# EAGLE design Emotion (EAGLE 9.3.0)
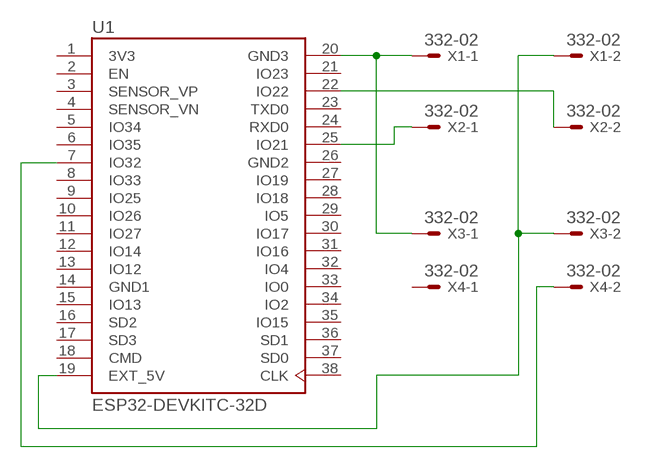
[diagram p0: schematic, sheet 1]

## Parts
U1  ESP32-DEVKITC-32D  [MODULE_ESP32-DEVKITC-32D]
X1  332-02  [332-02]
X2  332-02  [332-02]
X3  332-02  [332-02]
X4  332-02  [332-02]

## Nets
N$1: U1.20(GND3) X1.1 X3.1
N$2: U1.19(EXT_5V) X1.2 X3.2
N$3: U1.25(IO21) X2.1
N$4: U1.22(IO22) X2.2
N$5: U1.7(IO32) X4.2
Unconnected: U1.2(EN) U1.3(SENSOR_VP) U1.4(SENSOR_VN) U1.5(IO34) U1.6(IO35) U1.8(IO33) U1.9(IO25) U1.10(IO26) U1.11(IO27) U1.12(IO14) U1.13(IO12) U1.15(IO13) U1.16(SD2) U1.17(SD3) U1.18(CMD) U1.21(IO23) U1.23(TXD0) U1.24(RXD0) U1.27(IO19) U1.28(IO18) U1.29(IO5) U1.30(IO17) U1.31(IO16) U1.32(IO4) U1.33(IO0) U1.34(IO2) U1.35(IO15) U1.36(SD1) U1.37(SD0) U1.38(CLK) X4.1

## Power pins joined to a net without a drawn wire
3V3: U1.1(3V3)
GND1: U1.14(GND1)
GND2: U1.26(GND2)

## Library data of the parts
U1 = ESP32-DEVKITC-32D:ESP32-DEVKITC-32D: Eval Board For Esp-Wroom-32; AVAILABILITY: Unavailable; DESCRIPTION: Eval Board For Esp-Wroom-32; MF: Espressif Systems; MP: ESP32-DEVKITC-32D; PACKAGE: None; PRICE: None
X1-X4 = con-garry:332-02: 2 Pin - 2mm Dual Row Source: www.mpe-connector.de / garry_shortform_2012.pdf

## Board
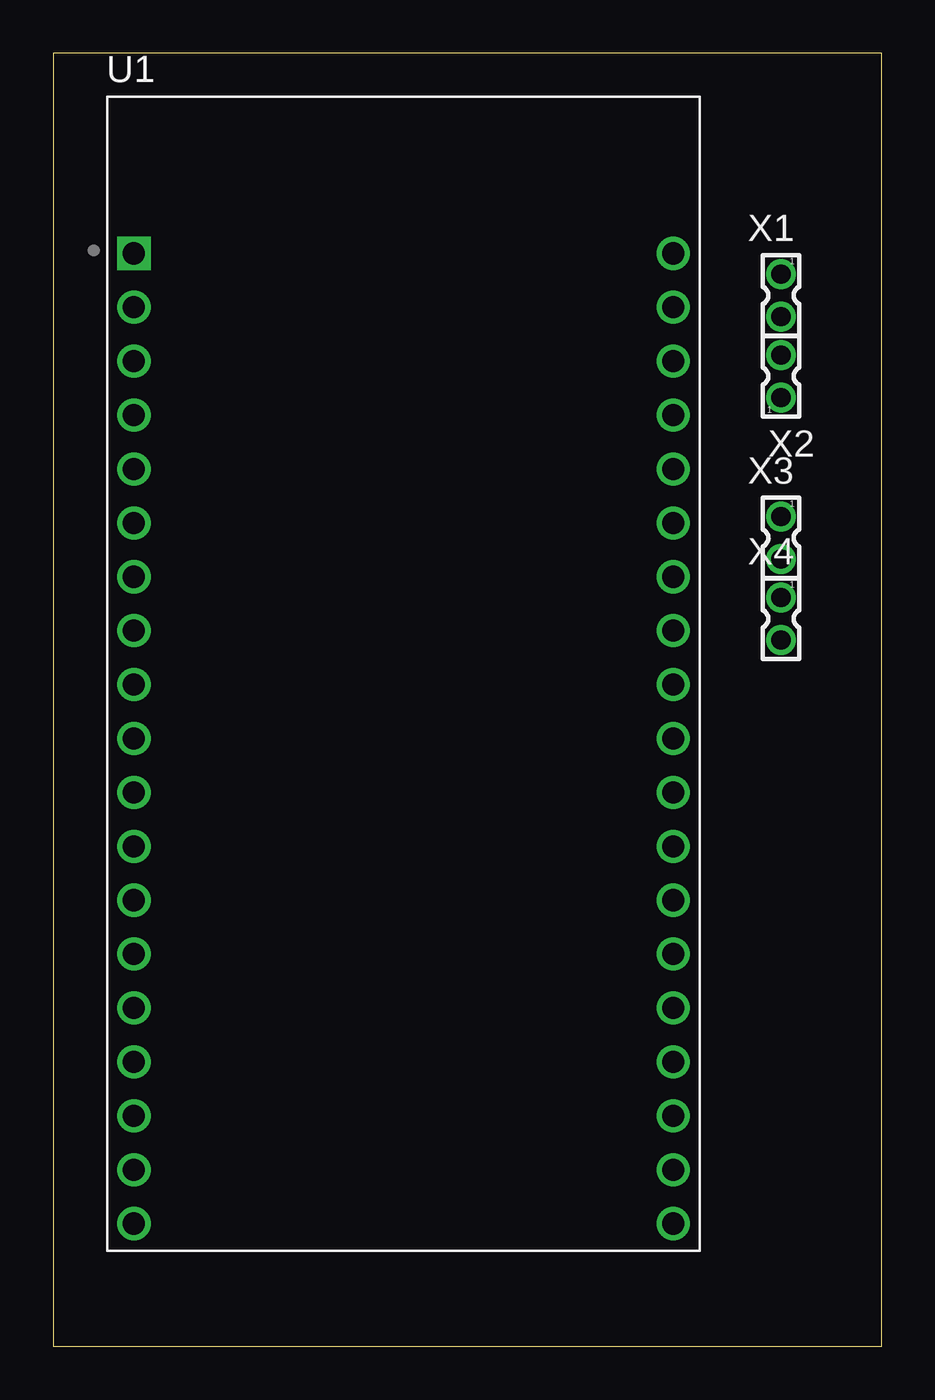
[diagram p1: board, top side]
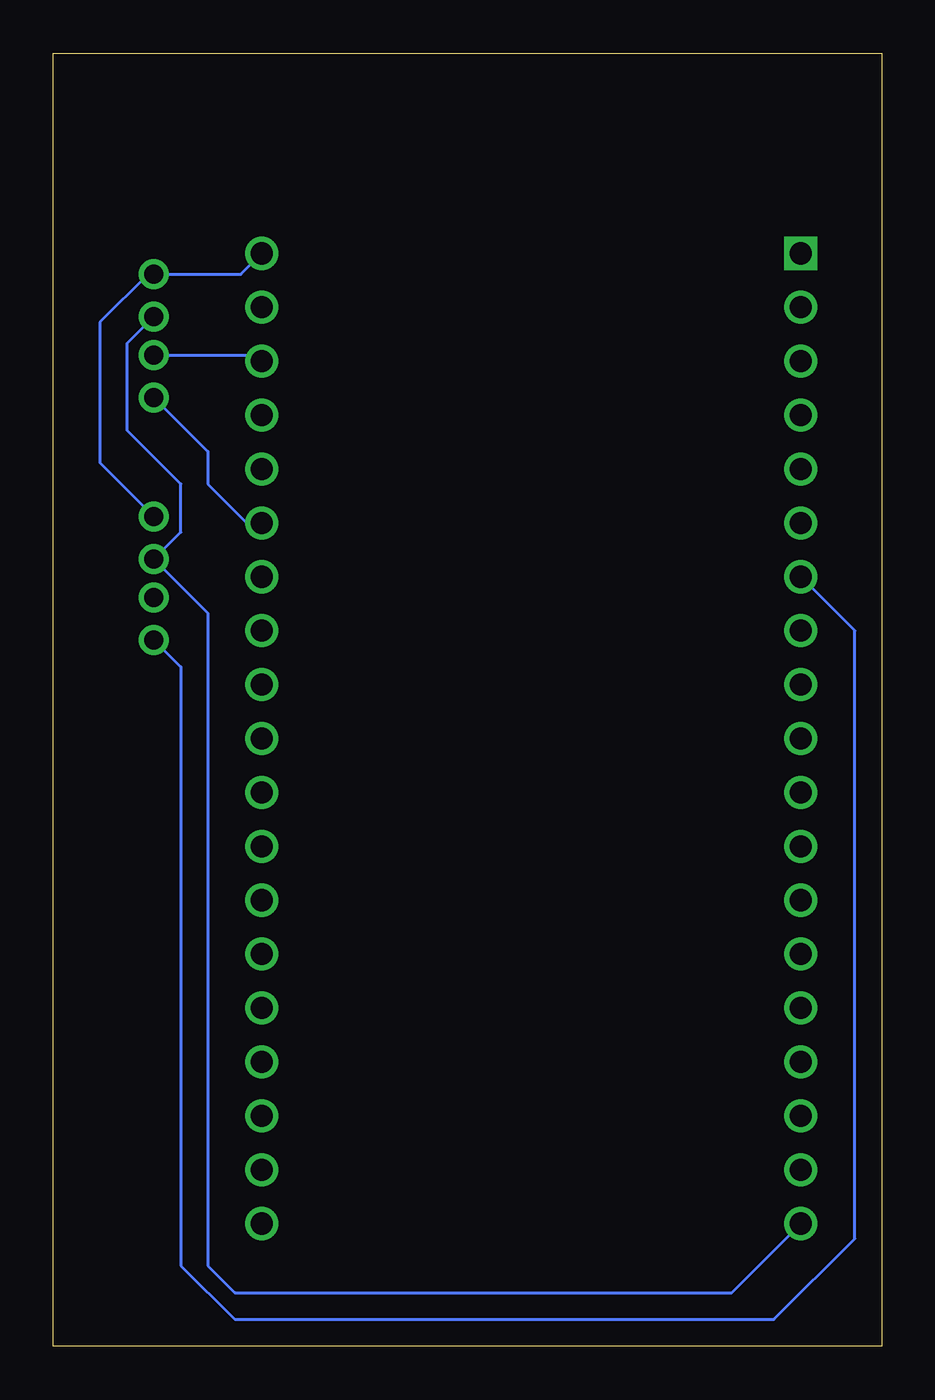
[diagram p2: board, bottom side, seen from below]

Size 39.04 x 60.95 mm. Coordinates in mm from the lower left corner, seen from the top.
Outline: 0,0 39.04,0 39.04,60.95 0,60.95 0,0
Copper layers (1*16): Top 0.035mm / dielectric 1.5mm / Bottom 0.035mm
Design rules "default": minimum track width 6mil, minimum drill 0.35mm, track to track 6mil, track to pad 6mil, pad to pad 6mil, via to via 6mil, smd to smd 6mil, copper to edge 40mil, drill to drill 6mil, minimum pad ring 10mil, minimum via ring 8mil, stop-mask expansion 4mil, vias tented up to drill 0mil, thermal gap 10mil

### Footprints (pad centres in the part's own frame; a part is rotated, then mirrored left to right if it is on the bottom)
MODULE_ESP32-DEVKITC-32D = drill 1.04 square: 1 -12.7,19.76 | drill 1.04: 2 -12.7,17.22; 3 -12.7,14.68; 4 -12.7,12.14; 5 -12.7,9.6; 6 -12.7,7.06; 7 -12.7,4.52; 8 -12.7,1.98; 9 -12.7,-0.56; 10 -12.7,-3.1; 11 -12.7,-5.64; 12 -12.7,-8.18; 13 -12.7,-10.72; 14 -12.7,-13.26; 15 -12.7,-15.8; 16 -12.7,-18.34; 17 -12.7,-20.88; 18 -12.7,-23.42; 19 -12.7,-25.96; 20 12.7,19.76; 21 12.7,17.22; 22 12.7,14.68; 23 12.7,12.14; 24 12.7,9.6; 25 12.7,7.06; 26 12.7,4.52; 27 12.7,1.98; 28 12.7,-0.56; 29 12.7,-3.1; 30 12.7,-5.64; 31 12.7,-8.18; 32 12.7,-10.72; 33 12.7,-13.26; 34 12.7,-15.8; 35 12.7,-18.34; 36 12.7,-20.88; 37 12.7,-23.42; 38 12.7,-25.96
332-02 = drill 0.9 pad 1.27: 1 0,-1; 2 0,1

### Placement (x,y rotation side)
U1  16.51,31.75 0 top
X1  34.29,49.53 180 top
X2  34.29,45.72 0 top
X3  34.29,38.1 180 top
X4  34.29,34.29 180 top

### Tracks (layer width: path | path; a pad name or v marks a point on that pad's centre or on a via)
N$1
  Bottom 0.152: U1.20 30.19,50.53 X1.1 34.56,50.53 36.83,48.26 36.83,41.64 X3.1
N$2
  Bottom 0.152: U1.19 7.06,2.54 30.48,2.54 31.75,3.81 31.75,34.56 X3.2 33.02,38.37 33.02,40.64 35.56,43.18 35.56,47.26 X1.2
N$3
  Bottom 0.152: X2.1 31.75,42.18 31.75,40.64 29.92,38.81 U1.25
N$4
  Bottom 0.152: X2.2 29.5,46.72 U1.22
N$5
  Bottom 0.152: X4.2 33.02,32.02 33.02,3.81 30.48,1.27 5.08,1.27 1.27,5.08 1.27,33.73 U1.7